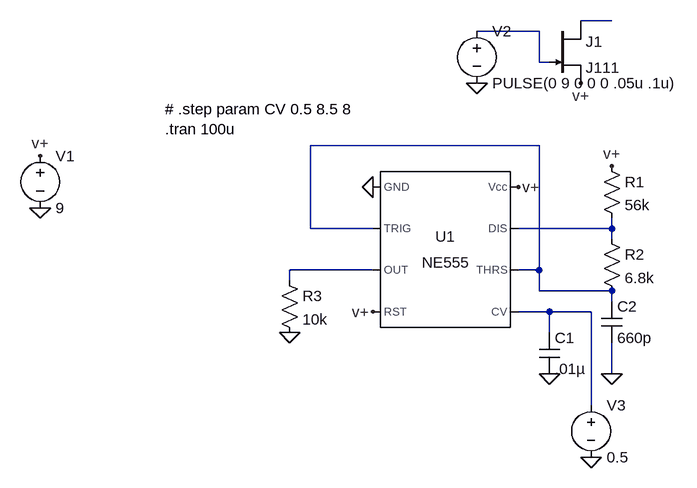
[diagram p0: schematic 555-clock.asc]
555-clock.asc, the LTspice schematic file:
Version 4
SHEET 1 1148 704
WIRE 640 -48 592 -48
WIRE 528 -32 432 -32
WIRE 528 16 528 -32
WIRE 544 16 528 16
WIRE 528 144 176 144
WIRE 176 272 176 144
WIRE 272 272 176 272
WIRE 640 272 640 256
WIRE 640 272 496 272
WIRE 640 288 640 272
WIRE 272 336 144 336
WIRE 528 336 528 144
WIRE 528 336 496 336
WIRE 144 352 144 336
WIRE 528 368 528 336
WIRE 640 368 528 368
WIRE 640 384 640 368
WIRE 544 400 496 400
WIRE 608 400 544 400
WIRE 544 432 544 400
WIRE 640 496 640 448
WIRE 608 544 608 400
FLAG -240 160 v+
FLAG 496 208 v+
FLAG 272 400 v+
FLAG -240 240 0
FLAG 272 208 0
FLAG 544 496 0
FLAG 640 496 0
FLAG 144 432 0
FLAG 592 48 v+
FLAG 432 48 0
FLAG 640 176 v+
FLAG 608 624 0
SYMBOL Misc/NE555 384 304 R0
SYMATTR InstName U1
SYMBOL voltage -240 144 R0
SYMATTR InstName V1
SYMATTR Value 9
SYMBOL cap 528 432 R0
SYMATTR InstName C1
SYMATTR Value .01µ
SYMBOL cap 624 384 R0
SYMATTR InstName C2
SYMATTR Value 660p
SYMBOL res 128 336 R0
SYMATTR InstName R3
SYMATTR Value 10k
SYMBOL res 624 272 R0
SYMATTR InstName R2
SYMATTR Value 6.8k
SYMBOL res 624 160 R0
SYMATTR InstName R1
SYMATTR Value 56k
SYMBOL voltage 432 -48 R0
SYMATTR InstName V2
SYMATTR Value PULSE(0 9 0 0 0 .05u .1u)
SYMBOL njf 544 -48 R0
SYMATTR InstName J1
SYMATTR Value J111
SYMBOL voltage 608 528 R0
SYMATTR InstName V3
SYMATTR Value 0.5
TEXT -48 88 Left 2 !# .step param CV 0.5 8.5 8\n.tran 100u

The netlist it stands for:
* 555-clock.asc
XU1 0 N003 N005 v+ N006 N003 N004 v+ NE555  ; pins GND TRIG OUT RST CV THRS DIS Vcc
V1 v+ 0 9
C1 N006 0 .01µ
C2 N003 0 660p
R3 N005 0 10k
R2 N004 N003 6.8k
R1 v+ N004 56k
V2 N002 0 PULSE(0 9 0 0 0 .05u .1u)
J1 N001 N002 v+ J111
V3 N006 0 0.5
.model NJF NJF
.model PJF PJF
.lib standard.jft
# .step param CV 0.5 8.5 8
.tran 100u
.lib NE555.sub
.backanno
.end